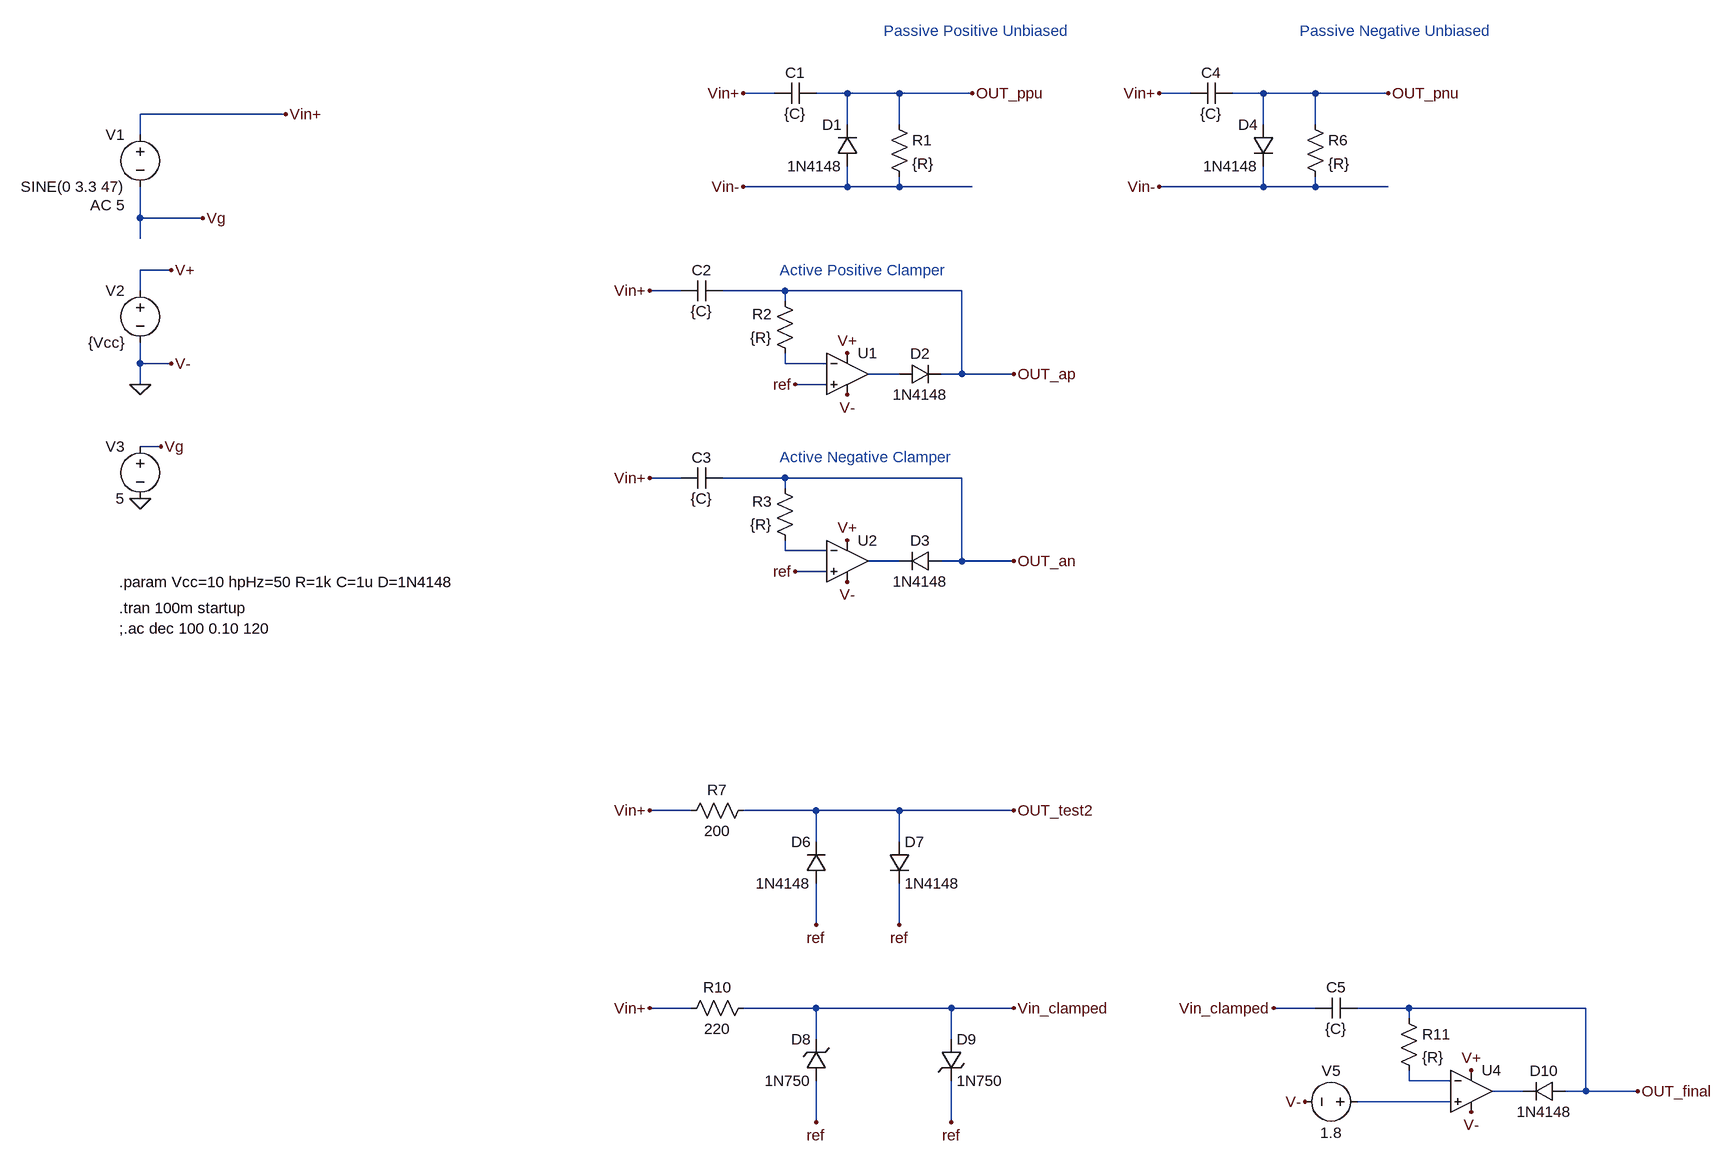
[diagram p0: schematic capstone_clamp_testing.asc]
capstone_clamp_testing.asc, the LTspice schematic file:
Version 4
SHEET 1 1652 1740
WIRE 192 80 144 80
WIRE 304 80 256 80
WIRE 384 80 304 80
WIRE 496 80 384 80
WIRE 832 80 784 80
WIRE 944 80 896 80
WIRE 1024 80 944 80
WIRE 1136 80 1024 80
WIRE -560 112 -784 112
WIRE 304 128 304 80
WIRE 384 128 384 80
WIRE 944 128 944 80
WIRE 1024 128 1024 80
WIRE -784 144 -784 112
WIRE 304 224 304 192
WIRE 304 224 144 224
WIRE 384 224 384 208
WIRE 384 224 304 224
WIRE 496 224 384 224
WIRE 944 224 944 192
WIRE 944 224 784 224
WIRE 1024 224 1024 208
WIRE 1024 224 944 224
WIRE 1136 224 1024 224
WIRE -784 272 -784 224
WIRE -688 272 -784 272
WIRE -784 304 -784 272
WIRE -736 352 -784 352
WIRE -784 384 -784 352
WIRE 48 384 0 384
WIRE 208 384 112 384
WIRE 480 384 208 384
WIRE 208 400 208 384
WIRE -784 496 -784 464
WIRE -736 496 -784 496
WIRE 208 496 208 480
WIRE 272 496 208 496
WIRE 384 512 336 512
WIRE 480 512 480 384
WIRE 480 512 448 512
WIRE 560 512 480 512
WIRE -784 528 -784 496
WIRE 272 528 224 528
WIRE -752 624 -784 624
WIRE 48 672 0 672
WIRE 208 672 112 672
WIRE 480 672 208 672
WIRE 208 688 208 672
WIRE 208 784 208 768
WIRE 272 784 208 784
WIRE 384 800 336 800
WIRE 480 800 480 672
WIRE 480 800 448 800
WIRE 560 800 480 800
WIRE 272 816 224 816
WIRE 64 1184 0 1184
WIRE 256 1184 144 1184
WIRE 384 1184 256 1184
WIRE 560 1184 384 1184
WIRE 256 1232 256 1184
WIRE 384 1232 384 1184
WIRE 256 1360 256 1296
WIRE 384 1360 384 1296
WIRE 64 1488 0 1488
WIRE 256 1488 144 1488
WIRE 464 1488 256 1488
WIRE 560 1488 464 1488
WIRE 1024 1488 960 1488
WIRE 1168 1488 1088 1488
WIRE 1440 1488 1168 1488
WIRE 1168 1504 1168 1488
WIRE 256 1536 256 1488
WIRE 464 1536 464 1488
WIRE 1168 1600 1168 1584
WIRE 1232 1600 1168 1600
WIRE 1344 1616 1296 1616
WIRE 1440 1616 1440 1488
WIRE 1440 1616 1408 1616
WIRE 1520 1616 1440 1616
WIRE 1232 1632 1088 1632
WIRE 256 1664 256 1600
WIRE 464 1664 464 1600
FLAG -560 112 Vin+
FLAG 144 80 Vin+
FLAG 496 80 OUT_ppu
FLAG 224 528 ref
FLAG -736 352 V+
FLAG 304 544 V-
FLAG 304 480 V+
FLAG 0 384 Vin+
FLAG 560 512 OUT_ap
FLAG 224 816 ref
FLAG 304 832 V-
FLAG 304 768 V+
FLAG 0 672 Vin+
FLAG 560 800 OUT_an
FLAG -736 496 V-
FLAG -784 528 0
FLAG 144 224 Vin-
FLAG 784 80 Vin+
FLAG 1136 80 OUT_pnu
FLAG 784 224 Vin-
FLAG 0 1184 Vin+
FLAG 560 1184 OUT_test2
FLAG 256 1360 ref
FLAG 384 1360 ref
FLAG 0 1488 Vin+
FLAG 256 1664 ref
FLAG 464 1664 ref
FLAG 560 1488 Vin_clamped
FLAG 1264 1648 V-
FLAG 1264 1584 V+
FLAG 1520 1616 OUT_final
FLAG 960 1488 Vin_clamped
FLAG 1008 1632 V-
FLAG -688 272 Vg
FLAG -784 704 0
FLAG -752 624 Vg
SYMBOL cap 256 64 R90
WINDOW 0 0 32 VBottom 2
WINDOW 3 32 32 VTop 2
SYMATTR InstName C1
SYMATTR Value {C}
SYMBOL res 368 112 R0
SYMATTR InstName R1
SYMATTR Value {R}
SYMBOL voltage -784 128 M0
WINDOW 123 24 124 Left 2
WINDOW 39 0 0 Left 0
SYMATTR Value2 AC 5
SYMATTR InstName V1
SYMATTR Value SINE(0 3.3 47)
SYMBOL Opamps\\UniversalOpamp2 304 512 R0
SYMATTR InstName U1
SYMBOL diode 384 528 R270
WINDOW 0 32 32 VTop 2
WINDOW 3 0 32 VBottom 2
SYMATTR InstName D2
SYMATTR Value 1N4148
SYMBOL voltage -784 368 M0
SYMATTR InstName V2
SYMATTR Value {Vcc}
SYMBOL res 224 496 R180
WINDOW 0 36 76 Left 2
WINDOW 3 36 40 Left 2
SYMATTR InstName R2
SYMATTR Value {R}
SYMBOL cap 112 368 R90
WINDOW 0 0 32 VBottom 2
WINDOW 3 32 32 VTop 2
SYMATTR InstName C2
SYMATTR Value {C}
SYMBOL Opamps\\UniversalOpamp2 304 800 R0
SYMATTR InstName U2
SYMBOL diode 448 784 R90
WINDOW 0 0 32 VBottom 2
WINDOW 3 32 32 VTop 2
SYMATTR InstName D3
SYMATTR Value 1N4148
SYMBOL res 224 784 R180
WINDOW 0 36 76 Left 2
WINDOW 3 36 40 Left 2
SYMATTR InstName R3
SYMATTR Value {R}
SYMBOL cap 112 656 R90
WINDOW 0 0 32 VBottom 2
WINDOW 3 32 32 VTop 2
SYMATTR InstName C3
SYMATTR Value {C}
SYMBOL diode 320 192 R180
WINDOW 0 24 64 Left 2
WINDOW 3 24 0 Left 2
SYMATTR InstName D1
SYMATTR Value 1N4148
SYMBOL cap 896 64 R90
WINDOW 0 0 32 VBottom 2
WINDOW 3 32 32 VTop 2
SYMATTR InstName C4
SYMATTR Value {C}
SYMBOL res 1008 112 R0
SYMATTR InstName R6
SYMATTR Value {R}
SYMBOL diode 960 128 M0
SYMATTR InstName D4
SYMATTR Value 1N4148
SYMBOL res 160 1168 R90
WINDOW 0 0 56 VBottom 2
WINDOW 3 32 56 VTop 2
SYMATTR InstName R7
SYMATTR Value 200
SYMBOL diode 272 1296 R180
WINDOW 0 24 64 Left 2
WINDOW 3 24 0 Left 2
SYMATTR InstName D6
SYMATTR Value 1N4148
SYMBOL diode 368 1232 R0
SYMATTR InstName D7
SYMATTR Value 1N4148
SYMBOL res 160 1472 R90
WINDOW 0 0 56 VBottom 2
WINDOW 3 32 56 VTop 2
SYMATTR InstName R10
SYMATTR Value 220
SYMBOL zener 272 1600 R180
WINDOW 0 24 64 Left 2
WINDOW 3 24 0 Left 2
SYMATTR InstName D8
SYMATTR Value 1N750
SYMATTR Description Diode
SYMATTR Type diode
SYMBOL zener 448 1536 R0
SYMATTR InstName D9
SYMATTR Value 1N750
SYMATTR Description Diode
SYMATTR Type diode
SYMBOL Opamps\\UniversalOpamp2 1264 1616 R0
SYMATTR InstName U4
SYMBOL diode 1408 1600 R90
WINDOW 0 0 32 VBottom 2
WINDOW 3 32 32 VTop 2
SYMATTR InstName D10
SYMATTR Value 1N4148
SYMBOL res 1152 1488 R0
SYMATTR InstName R11
SYMATTR Value {R}
SYMBOL cap 1088 1472 R90
WINDOW 0 0 32 VBottom 2
WINDOW 3 32 32 VTop 2
SYMATTR InstName C5
SYMATTR Value {C}
SYMBOL voltage 1104 1632 R90
WINDOW 0 -32 56 VBottom 2
WINDOW 3 32 56 VTop 2
SYMATTR InstName V5
SYMATTR Value 1.8
SYMBOL voltage -784 608 M0
SYMATTR InstName V3
SYMATTR Value 5
TEXT -816 872 Left 2 !.tran 100m startup
TEXT -816 832 Left 2 !.param Vcc=10 hpHz=50 R=1k C=1u D=1N4148
TEXT 200 352 Left 2 ;Active Positive Clamper
TEXT 200 640 Left 2 ;Active Negative Clamper
TEXT 360 -16 Left 2 ;Passive Positive Unbiased
TEXT 1000 -16 Left 2 ;Passive Negative Unbiased
TEXT -816 904 Left 2 !;.ac dec 100 0.10 120

The netlist it stands for:
* capstone_clamp_testing.asc
C1 OUT_ppu Vin+ {C}
R1 OUT_ppu Vin- {R}
V1 Vin+ Vg SINE(0 3.3 47) AC 5
XU1 ref N001 V+ 0 N002 level.2 Avol=1Meg GBW=10Meg Slew=10Meg ilimit=25m rail=0 Vos=0 phimargin=45 en=0 enk=0 in=0 ink=0 Rin=500Meg  ; pins IN+ IN- V+ V- OUT
D2 N002 OUT_ap 1N4148
V2 V+ 0 {Vcc}
R2 N001 OUT_ap {R}
C2 OUT_ap Vin+ {C}
XU2 ref N003 V+ 0 N004 level.2 Avol=1Meg GBW=10Meg Slew=10Meg ilimit=25m rail=0 Vos=0 phimargin=45 en=0 enk=0 in=0 ink=0 Rin=500Meg  ; pins IN+ IN- V+ V- OUT
D3 OUT_an N004 1N4148
R3 N003 OUT_an {R}
C3 OUT_an Vin+ {C}
D1 Vin- OUT_ppu 1N4148
C4 OUT_pnu Vin+ {C}
R6 OUT_pnu Vin- {R}
D4 OUT_pnu Vin- 1N4148
R7 OUT_test2 Vin+ 200
D6 ref OUT_test2 1N4148
D7 OUT_test2 ref 1N4148
R10 Vin_clamped Vin+ 220
D8 ref Vin_clamped 1N750
D9 Vin_clamped ref 1N750
XU4 N007 N005 V+ 0 N006 level.2 Avol=1Meg GBW=10Meg Slew=10Meg ilimit=25m rail=0 Vos=0 phimargin=45 en=0 enk=0 in=0 ink=0 Rin=500Meg  ; pins IN+ IN- V+ V- OUT
D10 OUT_final N006 1N4148
R11 OUT_final N005 {R}
C5 OUT_final Vin_clamped {C}
V5 N007 0 1.8
V3 Vg 0 5
.model D D
.lib standard.dio
.tran 100m startup
.param Vcc=10 hpHz=50 R=1k C=1u D=1N4148
* Active Positive Clamper
* Active Negative Clamper
* Passive Positive Unbiased
* Passive Negative Unbiased
;.ac dec 100 0.10 120
.lib UniversalOpamps2.sub
.backanno
.end